# Altium project Control_Board.PrjPcb
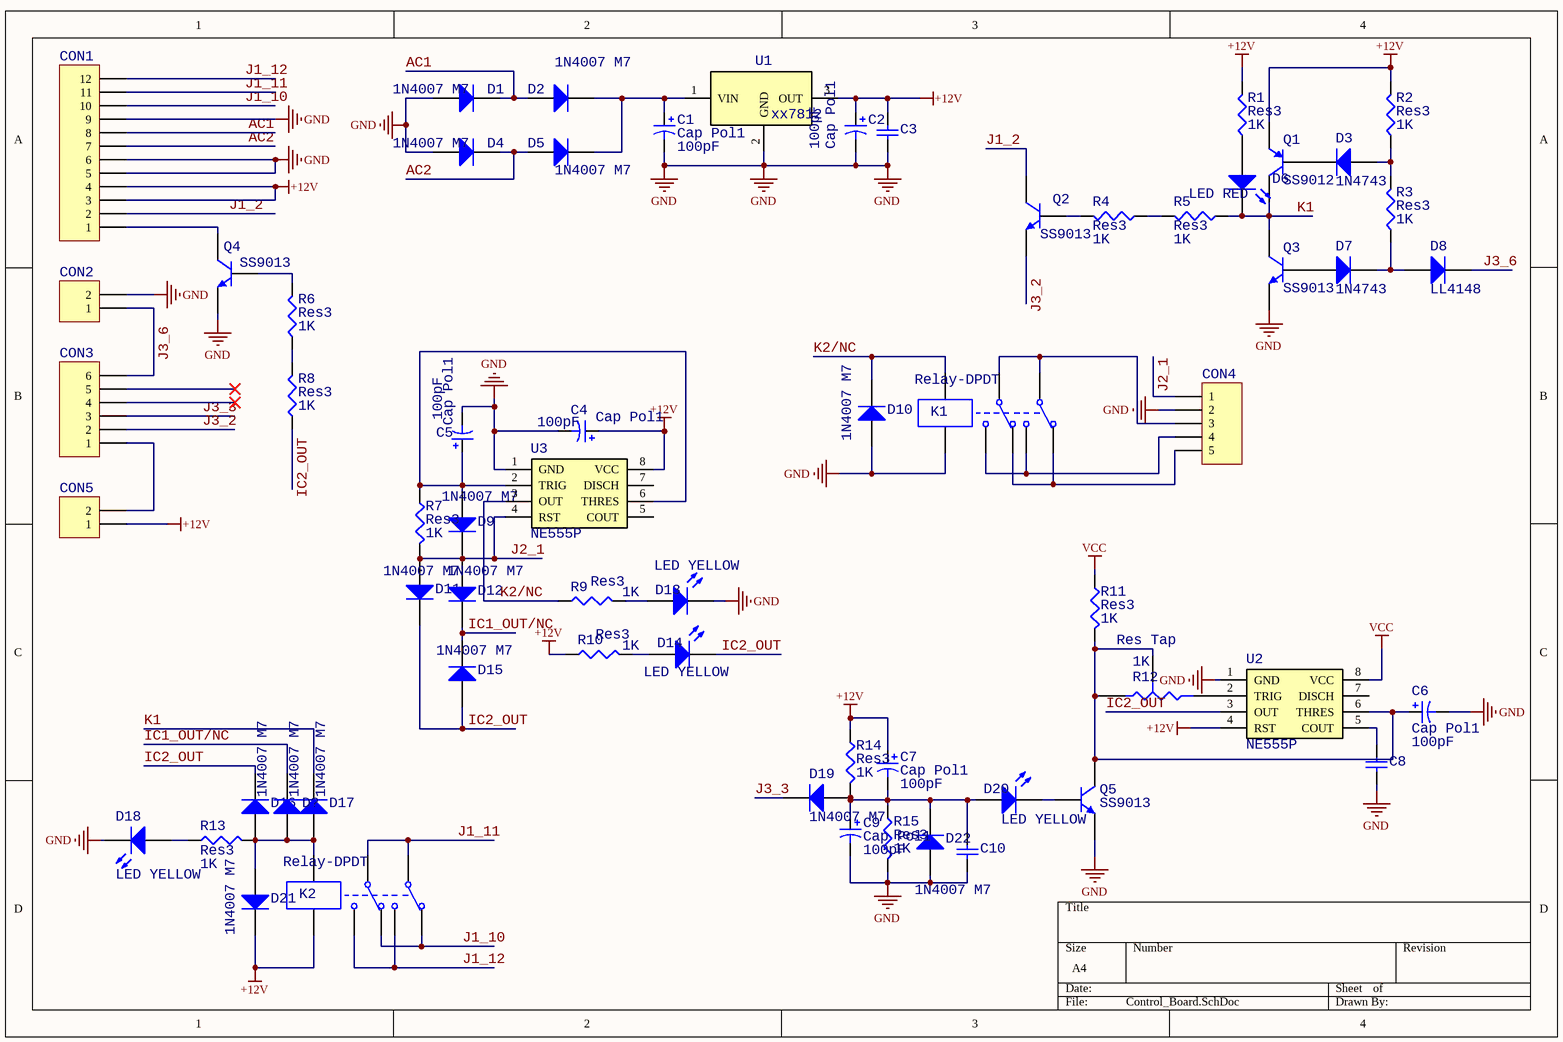
[diagram p0: Control_Board.SchDoc]
1 sheet, 63 parts. Net scope: global (net labels, ports and power ports of the same name join across sheets).
Board file: Control_Board.PcbDoc

## Sheet Control_Board.SchDoc
size A4

### Parts
C1  Cap Pol1  value 100pF  [RB7.6-15]
C2  Cap Pol1  value 100pF  [RB7.6-15]
C3  (no value)  [RAD-0.3]
C4  Cap Pol1  value 100pF  [RB7.6-15]
C5  Cap Pol1  value 100pF  [RB7.6-15]
C6  Cap Pol1  value 100pF  [RB7.6-15]
C7  Cap Pol1  value 100pF  [RB7.6-15]
C8  (no value)  [RAD-0.3]
C9  Cap Pol1  value 100pF  [RB7.6-15]
C10  (no value)  [RAD-0.3]
CON1  (no value)  [HDR1X12]
CON2  (no value)  [HDR1X2]
CON3  (no value)  [HDR1X6]
CON4  (no value)  [HDR1X5]
CON5  (no value)  [HDR1X2]
D1  1N4007 M7  [SMC]
D2  1N4007 M7  [SMC]
D3  1N4743  [SMC]
D4  1N4007 M7  [SMC]
D5  1N4007 M7  [SMC]
D6  LED RED  [3.2X1.6X1.1]
D7  1N4743  [SMC]
D8  LL4148  [SMC]
D9  1N4007 M7  [SMC]
D10  1N4007 M7  [SMC]
D11  1N4007 M7  [SMC]
D12  1N4007 M7  [SMC]
D13  LED YELLOW  [3.2X1.6X1.1]
D14  LED YELLOW  [3.2X1.6X1.1]
D15  1N4007 M7  [SMC]
D16  1N4007 M7  [SMC]
D17  1N4007 M7  [SMC]
D18  LED YELLOW  [3.2X1.6X1.1]
D19  1N4007 M7  [SMC]
D20  LED YELLOW  [3.2X1.6X1.1]
D21  1N4007 M7  [SMC]
D22  1N4007 M7  [SMC]
D?  1N4007 M7  [SMC]
K1  Relay-DPDT  [DIP-P8]
K2  Relay-DPDT  [DIP-P8]
Q1  SS9012  [SOT-23B_N]
Q2  SS9013  [SOT-23B_N]
Q3  SS9013  [SOT-23B_N]
Q4  SS9013  [SOT-23B_N]
Q5  SS9013  [SOT-23B_N]
R1  Res3  value 1K  [J1-0603]
R2  Res3  value 1K  [J1-0603]
R3  Res3  value 1K  [J1-0603]
R4  Res3  value 1K  [J1-0603]
R5  Res3  value 1K  [J1-0603]
R6  Res3  value 1K  [J1-0603]
R7  Res3  value 1K  [J1-0603]
R8  Res3  value 1K  [J1-0603]
R9  Res3  value 1K  [J1-0603]
R10  Res3  value 1K  [J1-0603]
R11  Res3  value 1K  [J1-0603]
R12  Res Tap  value 1K  [VR3]
R13  Res3  value 1K  [J1-0603]
R14  Res3  value 1K  [J1-0603]
R15  Res3  value 1K  [J1-0603]
U1  xx7812
U2  NE555P  [DIP8]
U3  NE555P  [DIP8]

### Nets
+12V: C2.1 C3.2 C4.1 C7.1 CON1.3 CON1.4 CON5.1 D21.2(K) K2.8 Q1.3(E) R1.2 R2.2 R10.1 R14.1 U1.3(OUT) U2.4(RST) U3.8(VCC)
GND: C1.2 C2.2 C3.1 C4.2 C5.2 C6.2 C8.1 C9.2 C10.1 CON1.5 CON1.6 CON1.9 CON2.2 CON4.2 D1.1(A) D4.1(A) D10.1(A) D13.2(K) D18.2(K) D22.1(A) K1.8 Q3.3(E) Q4.3(E) Q5.3(E) R15.2 U1.2(GND) U2.1(GND) U3.1(GND)
VCC: R11.1 U2.8(VCC)
AC1: CON1.8 D1.2(K) D2.1(A)
AC2: CON1.7 D4.2(K) D5.1(A)
IC1_OUT/NC: D12.2(K) D15.2(K) D?.2(K)
IC2_OUT: D11.2(K) D14.2(K) D15.1(A) D16.2(K) R8.1 U2.3(OUT)
J1_2: CON1.2 Q2.1(C)
J1_10: CON1.10 K2.2 K2.5
J1_11: CON1.11 K2.1 K2.4
J1_12: CON1.12 K2.3 K2.6
J2_1: CON4.1 D9.2(K) D11.1(A) R7.2 U3.4(RST)
J3_2: CON3.2 Q2.3(E)
J3_3: CON3.3 D19.2(K)
J3_6: CON2.1 CON3.6 D8.2(K)
K1: D6.2(K) D17.2(K) Q1.1(C) Q3.1(C) R5.1
K2/NC: D10.2(K) K1.7 R9.1 U3.3(OUT)
NetC1_1: C1.1 D2.2(K) D5.2(K) U1.1(VIN)
NetC5_1: C5.1 D9.1(A) R7.1 U3.2(TRIG) U3.6(THRES)
NetC6_1: C6.1 Q5.1(C) R11.2 R12.1(A) R12.3(TAP) U2.6(THRES)
NetC7_2: C7.2 C9.1 C10.2 D19.1(A) D20.1(A) D22.2(K) R14.2 R15.1
NetC8_2: C8.2 U2.5(COUT)
NetCON1_1: CON1.1 Q4.1(C)
NetCON3_1: CON3.1 CON5.2
NetCON4_3: CON4.3 K1.1 K1.4
NetCON4_4: CON4.4 K1.3 K1.6
NetCON4_5: CON4.5 K1.2 K1.5
NetD3_1: D3.1(A) R2.1 R3.2
NetD3_2: D3.2(K) Q1.2(B)
NetD6_1: D6.1(A) R1.1
NetD7_1: D7.1(A) Q3.2(B)
NetD7_2: D7.2(K) D8.1(A) R3.1
NetD13_1: D13.1(A) R9.2
NetD14_1: D14.1(A) R10.2
NetD16_1: D16.1(A) D17.1(A) D21.1(A) D?.1(A) K2.7 R13.2
NetD18_1: D18.1(A) R13.1
NetD20_2: D20.2(K) Q5.2(B)
NetQ2_2: Q2.2(B) R4.2
NetQ4_2: Q4.2(B) R6.2
NetR4_1: R4.1 R5.2
NetR6_1: R6.1 R8.2
NetR12_2: R12.2(B) U2.2(TRIG)

Not connected (* = marked no-connect by the designer): CON3 4* 5*; D12 1(A); U2 7(DISCH); U3 5(COUT) 7(DISCH)

### Library data of the parts
C1 C2 C4-C7 C9 = Cap Pol1: Polarized Capacitor (Radial); Published: 8-Jun-2000; LatestRevisionDate: 17-Jul-2002; LatestRevisionNote: Re-released for DXP Platform.; PackageReference: RB7.6-15; Publisher: Altium Limited; PackageDescription: Polarized Capacitor (Radial); 2 Leads
C3 C8 C10 = Cap: Capacitor; Published: 8-Jun-2000; LatestRevisionDate: 17-Jul-2002; LatestRevisionNote: Re-released for DXP Platform.; PackageReference: RAD-0.3; Publisher: Altium Limited; PackageDescription: Radial Cap, Thru-Hole; 2 Leads; 0.3 in Pin Spacing
CON1 = Header 12: Header, 12-Pin; LatestRevisionDate: 17-Jul-2002; LatestRevisionNote: Re-released for DXP Platform.; Publisher: Altium Limited
CON2 CON5 = Header 2: Header, 2-Pin; LatestRevisionDate: 17-Jul-2002; LatestRevisionNote: Re-released for DXP Platform.; Publisher: Altium Limited
CON3 = Header 6: Header, 6-Pin; LatestRevisionDate: 17-Jul-2002; LatestRevisionNote: Re-released for DXP Platform.; Publisher: Altium Limited
CON4 = Header 5: Header, 5-Pin; LatestRevisionDate: 17-Jul-2002; LatestRevisionNote: Re-released for DXP Platform.; Publisher: Altium Limited
D1-D5 D7-D12 D15-D17 D19 D21 D22 D? = Diode: Default Diode; Published: 8-Jun-2000; LatestRevisionDate: 17-Jul-2002; LatestRevisionNote: Re-released for DXP Platform.; PackageVersion: Sep-1996; PackageReference: SMC; Publisher: Altium Limited; PackageDescription: DO-214-AB/SMC; 2 C-Bend Leads; Body 7.9 x 5.9 mm, inc. leads (LxW); Code_JEDEC: DO-214-AB
D6 D13 D14 D18 D20 = LED2: Typical RED, GREEN, YELLOW, AMBER GaAs LED; Published: 8-Jun-2000; LatestRevisionDate: 17-Jul-2002; LatestRevisionNote: Re-released for DXP Platform.; PackageVersion: Feb-2002; PackageReference: 3.2X1.6X1.1; Publisher: Altium Limited; PackageDescription: SM LED; 2 Flat Leads
K1 K2 = Relay-DPDT: Dual-Pole Dual-Throw Relay; Published: 24-Mar-1999; LatestRevisionDate: 17-Jul-2002; LatestRevisionNote: Re-released for DXP Platform.; PackageReference: DIP-P8; Publisher: Altium Limited; PackageDescription: Relay; 8 Leads
Q1 = PNP: PNP Bipolar Transistor; Published: 8-Jun-2000; LatestRevisionDate: 29-May-2009; LatestRevisionNote: IPC-7351 Footprint Added.; PackageVersion: Aug-1999; PackageReference: SOT-23B; Publisher: Altium Limited; PackageDescription: 3-Pin SOT-23 Package 0.95 mm Pitch, 2.4 mm Lead Span
Q2-Q5 = QNPN: NPN Bipolar Transistor; Published: 8-Jun-2000; LatestRevisionDate: 29-May-2009; LatestRevisionNote: IPC-7351 Footprint Added.; PackageVersion: Aug-1999; PackageReference: SOT-23B; Publisher: Altium Limited; PackageDescription: 3-Pin SOT-23 Package 0.95 mm Pitch, 2.4 mm Lead Span
R1-R11 R13-R15 = Res3: Resistor; Published: 8-Jun-2000; LatestRevisionDate: 29-May-2009; LatestRevisionNote: IPC-7351 Footprint Added.; PackageReference: J1-0603; Publisher: Altium Limited; PackageDescription: Chip Resistor
R12 = Res Tap: Tapped Resistor; Sim Note: Enter the Resistance value and the set point into parameter fields.; Set Position: 0.5; Published: 24-Mar-1999; LatestRevisionDate: 17-Jul-2002; LatestRevisionNote: Re-released for DXP Platform.; PackageReference: VR3; Publisher: Altium Limited; PackageDescription: Variable Resistor, Thru-Hole; 3 Leads